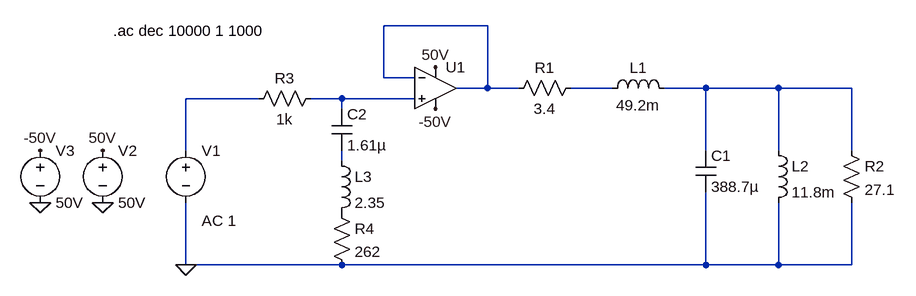
[diagram p0: schematic basic_pyle_notch.asc]
basic_pyle_notch.asc, the LTspice schematic file:
Version 4
SHEET 1 1380 680
WIRE 528 -176 368 -176
WIRE 368 -96 368 -176
WIRE 416 -96 368 -96
WIRE 528 -80 528 -176
WIRE 528 -80 480 -80
WIRE 576 -80 528 -80
WIRE 720 -80 656 -80
WIRE 864 -80 800 -80
WIRE 976 -80 864 -80
WIRE 1088 -80 976 -80
WIRE 176 -64 64 -64
WIRE 304 -64 256 -64
WIRE 416 -64 304 -64
WIRE 304 -48 304 -64
WIRE 64 16 64 -64
WIRE 864 16 864 -80
WIRE 976 16 976 -80
WIRE 1088 16 1088 -80
WIRE 304 32 304 16
WIRE 64 192 64 96
WIRE 304 192 64 192
WIRE 864 192 864 80
WIRE 864 192 304 192
WIRE 976 192 976 96
WIRE 976 192 864 192
WIRE 1088 192 1088 96
WIRE 1088 192 976 192
FLAG 64 192 0
FLAG -64 16 50V
FLAG -160 16 -50V
FLAG -160 96 0
FLAG -64 96 0
FLAG 448 -112 50V
FLAG 448 -48 -50V
SYMBOL voltage 64 0 R0
WINDOW 123 24 124 Left 2
WINDOW 39 0 0 Left 0
SYMATTR Value2 AC 1
SYMATTR InstName V1
SYMATTR Value ""
SYMBOL res 672 -96 R90
WINDOW 0 0 56 VBottom 2
WINDOW 3 32 56 VTop 2
SYMATTR InstName R1
SYMATTR Value 3.4
SYMBOL ind 704 -64 R270
WINDOW 0 32 56 VTop 2
WINDOW 3 5 56 VBottom 2
SYMATTR InstName L1
SYMATTR Value 49.2m
SYMBOL cap 848 16 R0
SYMATTR InstName C1
SYMATTR Value 388.7µ
SYMBOL ind 960 0 R0
SYMATTR InstName L2
SYMATTR Value 11.8m
SYMBOL res 1072 0 R0
SYMATTR InstName R2
SYMATTR Value 27.1
SYMBOL res 272 -80 R90
WINDOW 0 0 56 VBottom 2
WINDOW 3 32 56 VTop 2
SYMATTR InstName R3
SYMATTR Value 1k
SYMBOL cap 288 -48 R0
SYMATTR InstName C2
SYMATTR Value 1.61µ
SYMBOL ind 288 16 R0
SYMATTR InstName L3
SYMATTR Value 2.35
SYMBOL res 288 96 R0
SYMATTR InstName R4
SYMATTR Value 262
SYMBOL Opamps\\UniversalOpamp2 448 -80 R0
SYMATTR InstName U1
SYMBOL voltage -64 0 R0
WINDOW 123 0 0 Left 0
WINDOW 39 0 0 Left 0
SYMATTR InstName V2
SYMATTR Value 50V
SYMBOL voltage -160 0 R0
WINDOW 123 0 0 Left 0
WINDOW 39 0 0 Left 0
SYMATTR InstName V3
SYMATTR Value 50V
TEXT -48 -168 Left 2 !.ac dec 10000 1 1000

The netlist it stands for:
* basic_pyle_notch.asc
V1 N004 0 AC 1
R1 N002 N001 3.4
L1 N002 N003 49.2m
C1 N003 0 388.7µ
L2 N003 0 11.8m
R2 N003 0 27.1
R3 N005 N004 1k
C2 N005 N006 1.61µ
L3 N006 P001 2.35
R4 P001 0 262
XU1 N005 N001 50V -50V N001 level.2 Avol=1Meg GBW=10Meg Slew=10Meg ilimit=25m rail=0 Vos=0 phimargin=45 en=0 enk=0 in=0 ink=0 Rin=500Meg  ; pins IN+ IN- V+ V- OUT
V2 50V 0 50V
V3 -50V 0 50V
.ac dec 10000 1 1000
.lib UniversalOpamps2.sub
.backanno
.end